# Altium schematic sheet [03] - MATRIX SCHEMATIC.SchDoc
size A2; DocumentNumber: 3; SheetNumber: 3; SheetTotal: 5; PageSetup: Record=PageOptions|CenterHorizontal=True|CenterVertical=True|PrintScale=0.73|XCorrection=1.00|YCorrection=1.00|PrintKind=0|BorderSize=5000000|LeftOffset=0|BottomOffset=0|Orientation=2|PaperLength=1000|PaperWidth=1000|Scale=100|PaperSource=7|PrintQuality=-3|MediaType=1|DitherType=10|PrintScaleMode=1|PaperKind=A3|PaperIndex=8
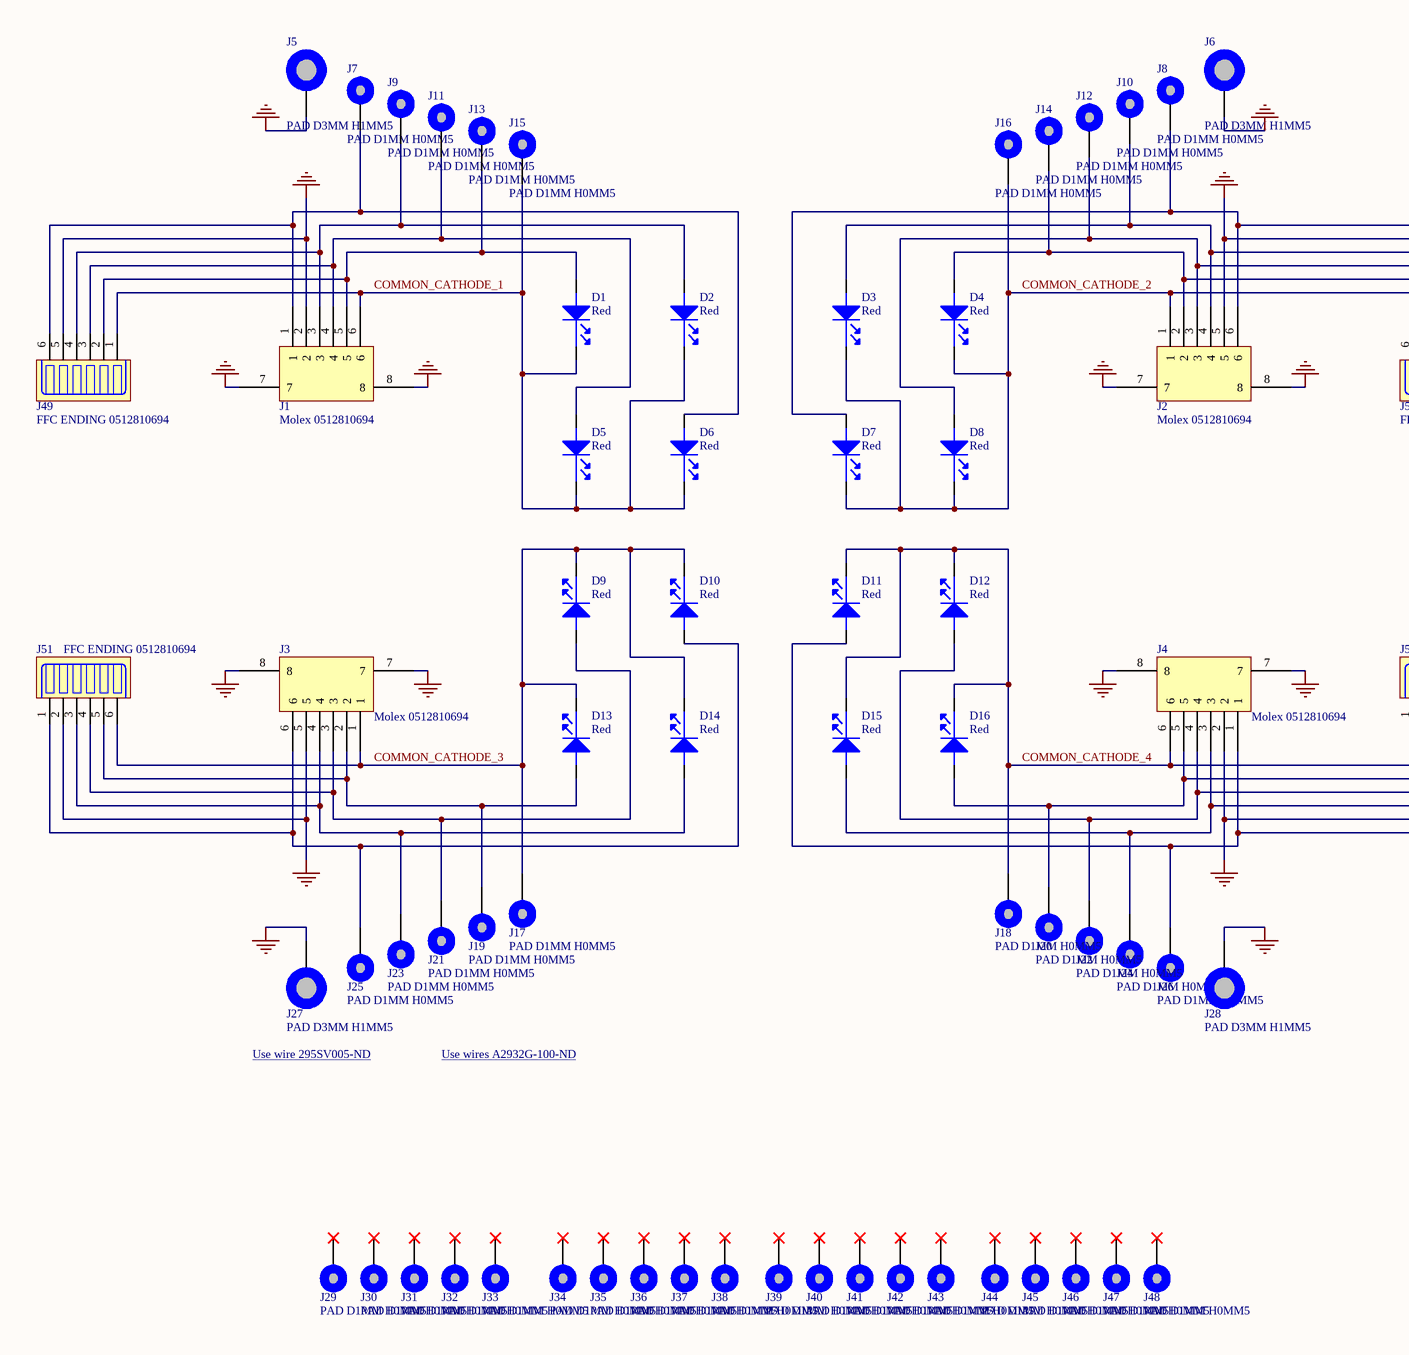
[diagram p0: [03] - MATRIX SCHEMATIC.SchDoc, left]
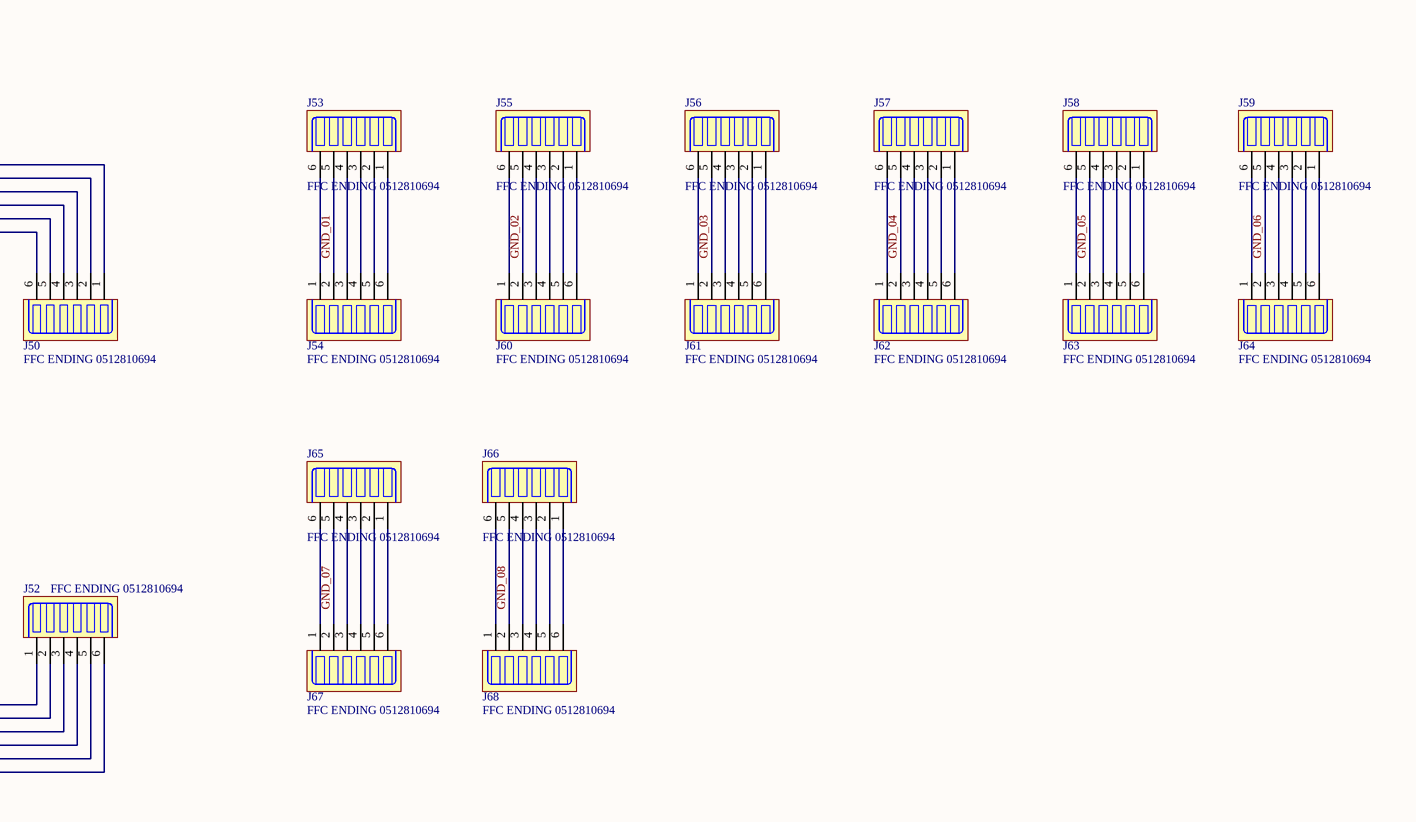
[diagram p1: [03] - MATRIX SCHEMATIC.SchDoc, right]

## Parts
D1  Red  [LED_0603]
D2  Red  [LED_0603]
D3  Red  [LED_0603]
D4  Red  [LED_0603]
D5  Red  [LED_0603]
D6  Red  [LED_0603]
D7  Red  [LED_0603]
D8  Red  [LED_0603]
D9  Red  [LED_0603]
D10  Red  [LED_0603]
D11  Red  [LED_0603]
D12  Red  [LED_0603]
D13  Red  [LED_0603]
D14  Red  [LED_0603]
D15  Red  [LED_0603]
D16  Red  [LED_0603]
J1  Molex 0512810694  [0512810694]
J2  Molex 0512810694  [0512810694]
J3  Molex 0512810694  [0512810694]
J4  Molex 0512810694  [0512810694]
J5  PAD D3MM H1MM5  [PAD_D3MM_H1MM5]  (no BOM)
J6  PAD D3MM H1MM5  [PAD_D3MM_H1MM5]  (no BOM)
J7  PAD D1MM H0MM5  [PAD_D1MM_H0MM5]  (no BOM)
J8  PAD D1MM H0MM5  [PAD_D1MM_H0MM5]  (no BOM)
J9  PAD D1MM H0MM5  [PAD_D1MM_H0MM5]  (no BOM)
J10  PAD D1MM H0MM5  [PAD_D1MM_H0MM5]  (no BOM)
J11  PAD D1MM H0MM5  [PAD_D1MM_H0MM5]  (no BOM)
J12  PAD D1MM H0MM5  [PAD_D1MM_H0MM5]  (no BOM)
J13  PAD D1MM H0MM5  [PAD_D1MM_H0MM5]  (no BOM)
J14  PAD D1MM H0MM5  [PAD_D1MM_H0MM5]  (no BOM)
J15  PAD D1MM H0MM5  [PAD_D1MM_H0MM5]  (no BOM)
J16  PAD D1MM H0MM5  [PAD_D1MM_H0MM5]  (no BOM)
J17  PAD D1MM H0MM5  [PAD_D1MM_H0MM5]  (no BOM)
J18  PAD D1MM H0MM5  [PAD_D1MM_H0MM5]  (no BOM)
J19  PAD D1MM H0MM5  [PAD_D1MM_H0MM5]  (no BOM)
J20  PAD D1MM H0MM5  [PAD_D1MM_H0MM5]  (no BOM)
J21  PAD D1MM H0MM5  [PAD_D1MM_H0MM5]  (no BOM)
J22  PAD D1MM H0MM5  [PAD_D1MM_H0MM5]  (no BOM)
J23  PAD D1MM H0MM5  [PAD_D1MM_H0MM5]  (no BOM)
J24  PAD D1MM H0MM5  [PAD_D1MM_H0MM5]  (no BOM)
J25  PAD D1MM H0MM5  [PAD_D1MM_H0MM5]  (no BOM)
J26  PAD D1MM H0MM5  [PAD_D1MM_H0MM5]  (no BOM)
J27  PAD D3MM H1MM5  [PAD_D3MM_H1MM5]  (no BOM)
J28  PAD D3MM H1MM5  [PAD_D3MM_H1MM5]  (no BOM)
J29  PAD D1MM H0MM5  [PAD_D1MM_H0MM5]  (no BOM)
J30  PAD D1MM H0MM5  [PAD_D1MM_H0MM5]  (no BOM)
J31  PAD D1MM H0MM5  [PAD_D1MM_H0MM5]  (no BOM)
J32  PAD D1MM H0MM5  [PAD_D1MM_H0MM5]  (no BOM)
J33  PAD D1MM H0MM5  [PAD_D1MM_H0MM5]  (no BOM)
J34  PAD D1MM H0MM5  [PAD_D1MM_H0MM5]  (no BOM)
J35  PAD D1MM H0MM5  [PAD_D1MM_H0MM5]  (no BOM)
J36  PAD D1MM H0MM5  [PAD_D1MM_H0MM5]  (no BOM)
J37  PAD D1MM H0MM5  [PAD_D1MM_H0MM5]  (no BOM)
J38  PAD D1MM H0MM5  [PAD_D1MM_H0MM5]  (no BOM)
J39  PAD D1MM H0MM5  [PAD_D1MM_H0MM5]  (no BOM)
J40  PAD D1MM H0MM5  [PAD_D1MM_H0MM5]  (no BOM)
J41  PAD D1MM H0MM5  [PAD_D1MM_H0MM5]  (no BOM)
J42  PAD D1MM H0MM5  [PAD_D1MM_H0MM5]  (no BOM)
J43  PAD D1MM H0MM5  [PAD_D1MM_H0MM5]  (no BOM)
J44  PAD D1MM H0MM5  [PAD_D1MM_H0MM5]  (no BOM)
J45  PAD D1MM H0MM5  [PAD_D1MM_H0MM5]  (no BOM)
J46  PAD D1MM H0MM5  [PAD_D1MM_H0MM5]  (no BOM)
J47  PAD D1MM H0MM5  [PAD_D1MM_H0MM5]  (no BOM)
J48  PAD D1MM H0MM5  [PAD_D1MM_H0MM5]  (no BOM)
J49  FFC ENDING 0512810694  [FFC_ENDING_0512810694]  (no BOM)
J50  FFC ENDING 0512810694  [FFC_ENDING_0512810694]  (no BOM)
J51  FFC ENDING 0512810694  [FFC_ENDING_0512810694]  (no BOM)
J52  FFC ENDING 0512810694  [FFC_ENDING_0512810694]  (no BOM)
J53  FFC ENDING 0512810694  [FFC_ENDING_0512810694]  (no BOM)
J54  FFC ENDING 0512810694  [FFC_ENDING_0512810694]  (no BOM)
J55  FFC ENDING 0512810694  [FFC_ENDING_0512810694]  (no BOM)
J56  FFC ENDING 0512810694  [FFC_ENDING_0512810694]  (no BOM)
J57  FFC ENDING 0512810694  [FFC_ENDING_0512810694]  (no BOM)
J58  FFC ENDING 0512810694  [FFC_ENDING_0512810694]  (no BOM)
J59  FFC ENDING 0512810694  [FFC_ENDING_0512810694]  (no BOM)
J60  FFC ENDING 0512810694  [FFC_ENDING_0512810694]  (no BOM)
J61  FFC ENDING 0512810694  [FFC_ENDING_0512810694]  (no BOM)
J62  FFC ENDING 0512810694  [FFC_ENDING_0512810694]  (no BOM)
J63  FFC ENDING 0512810694  [FFC_ENDING_0512810694]  (no BOM)
J64  FFC ENDING 0512810694  [FFC_ENDING_0512810694]  (no BOM)
J65  FFC ENDING 0512810694  [FFC_ENDING_0512810694]  (no BOM)
J66  FFC ENDING 0512810694  [FFC_ENDING_0512810694]  (no BOM)
J67  FFC ENDING 0512810694  [FFC_ENDING_0512810694]  (no BOM)
J68  FFC ENDING 0512810694  [FFC_ENDING_0512810694]  (no BOM)

## Nets
GND: J1.2 J1.7 J1.8 J2.5 J2.7 J2.8 J3.5 J3.7 J3.8 J4.2 J4.7 J4.8 J5.1 J6.1 J27.1 J28.1 J49.5 J50.2 J51.2 J52.5
COMMON_CATHODE_1: D1.1(cathode) D2.1(cathode) D5.1(cathode) D6.1(cathode) J1.6 J15.1 J49.1
COMMON_CATHODE_2: D3.1(cathode) D4.1(cathode) D7.1(cathode) D8.1(cathode) J2.1 J16.1 J50.6
COMMON_CATHODE_3: D9.1(cathode) D10.1(cathode) D13.1(cathode) D14.1(cathode) J3.1 J17.1 J51.6
COMMON_CATHODE_4: D11.1(cathode) D12.1(cathode) D15.1(cathode) D16.1(cathode) J4.6 J18.1 J52.1
GND_01: J53.5 J54.2
GND_02: J55.5 J60.2
GND_03: J56.5 J61.2
GND_04: J57.5 J62.2
GND_05: J58.5 J63.2
GND_06: J59.5 J64.2
GND_07: J65.5 J67.2
GND_08: J66.5 J68.2
NetD1_2: D1.2(ANODE) J1.5 J13.1 J49.2
NetD2_2: D2.2(ANODE) J1.3 J9.1 J49.4
NetD3_2: D3.2(ANODE) J2.4 J10.1 J50.3
NetD4_2: D4.2(ANODE) J2.2 J14.1 J50.5
NetD5_2: D5.2(ANODE) J1.4 J11.1 J49.3
NetD6_2: D6.2(ANODE) J1.1 J7.1 J49.6
NetD7_2: D7.2(ANODE) J2.6 J8.1 J50.1
NetD8_2: D8.2(ANODE) J2.3 J12.1 J50.4
NetD9_2: D9.2(ANODE) J3.3 J21.1 J51.4
NetD10_2: D10.2(ANODE) J3.6 J25.1 J51.1
NetD11_2: D11.2(ANODE) J4.1 J26.1 J52.6
NetD12_2: D12.2(ANODE) J4.4 J22.1 J52.3
NetD13_2: D13.2(ANODE) J3.2 J19.1 J51.5
NetD14_2: D14.2(ANODE) J3.4 J23.1 J51.3
NetD15_2: D15.2(ANODE) J4.3 J24.1 J52.4
NetD16_2: D16.2(ANODE) J4.5 J20.1 J52.2
NetJ53_1: J53.1 J54.6
NetJ53_2: J53.2 J54.5
NetJ53_3: J53.3 J54.4
NetJ53_4: J53.4 J54.3
NetJ53_6: J53.6 J54.1
NetJ55_1: J55.1 J60.6
NetJ55_2: J55.2 J60.5
NetJ55_3: J55.3 J60.4
NetJ55_4: J55.4 J60.3
NetJ55_6: J55.6 J60.1
NetJ56_1: J56.1 J61.6
NetJ56_2: J56.2 J61.5
NetJ56_3: J56.3 J61.4
NetJ56_4: J56.4 J61.3
NetJ56_6: J56.6 J61.1
NetJ57_1: J57.1 J62.6
NetJ57_2: J57.2 J62.5
NetJ57_3: J57.3 J62.4
NetJ57_4: J57.4 J62.3
NetJ57_6: J57.6 J62.1
NetJ58_1: J58.1 J63.6
NetJ58_2: J58.2 J63.5
NetJ58_3: J58.3 J63.4
NetJ58_4: J58.4 J63.3
NetJ58_6: J58.6 J63.1
NetJ59_1: J59.1 J64.6
NetJ59_2: J59.2 J64.5
NetJ59_3: J59.3 J64.4
NetJ59_4: J59.4 J64.3
NetJ59_6: J59.6 J64.1
NetJ65_1: J65.1 J67.6
NetJ65_2: J65.2 J67.5
NetJ65_3: J65.3 J67.4
NetJ65_4: J65.4 J67.3
NetJ65_6: J65.6 J67.1
NetJ66_1: J66.1 J68.6
NetJ66_2: J66.2 J68.5
NetJ66_3: J66.3 J68.4
NetJ66_4: J66.4 J68.3
NetJ66_6: J66.6 J68.1

Not connected (* = marked no-connect by the designer): J29 1*; J30 1*; J31 1*; J32 1*; J33 1*; J34 1*; J35 1*; J36 1*; J37 1*; J38 1*; J39 1*; J40 1*; J41 1*; J42 1*; J43 1*; J44 1*; J45 1*; J46 1*; J47 1*; J48 1*

## Notes on the sheet
- Use wire 295SV005-ND <https://www.digikey.com/products/en?keywords=%09295%20SV005>
- Use wires A2932G-100-ND <https://www.digikey.com/product-detail/en/alpha-wire/2932-GR005/A2932G-100-ND/7349790>

## Library data of the parts
D1-D16 = LS L29K-H1J2-1-Z: LED SMARTLED RED 630NM 0603 SMD; Manufacturer: OSRAM Opto Semiconductors Inc; Millicandela Rating: 4.95mcd; Voltage - Forward (Vf) Typ: 1.8V; Current - Test: 2mA; Wavelength - Peak: 643nm; Viewing Angle: 160°; Lens Type: Diffused; Lens Style/Size: Rectangle with Flat Top, 1.3mm x 0.8mm; Luminous Flux @ Current - Test: 20 mlm; .Checked PCB: used; Supplier 1: Digi-Key; Supplier Part Number 1: 475-1195-1-ND; Manufacturer Part Number: LS L29K-H1J2-1-Z; RoHS: RoHS Compliant; Category: Optoelectronics; Stock 1: 71670; Pricing 1: 1=0.16, 10=0.137, 100=0.1093, 250=0.09564, 500=0.08744 (USD); Color: Red; Wavelength - Dominant: 630nm; Package / Case: 0603 (1608 Metric); Size / Dimension: 1.70mm L x 0.80mm W; Height: 0.65mm; Mounting Type: Surface Mount; Packaging: Cut Tape (CT); ComponentLink1URL: http://catalog.osram-os.com/catalogue/catalogue.do;jsessionid=DB7CFDBAC5AF1E216E45F622E867085A?act=downloadFile&favOid=020000010003f9de000100b6; ComponentLink1Description: http://catalog.osram-os.com/catalogue/catalogue.do;jsessionid=DB7CFDBAC5AF1E216E45F622E867085A?act=downloadFile&favOid=020000010003f9de000100b6; .Checked SCH: used
J1-J4 = 0512810694: Conn FPC Connector SKT 6 POS 0.5mm Solder RA SMD Easy-On™ Embossed T/R; Current Rating: 500mA; Voltage Rating: 50V; Contact Resistance: 20mR; Number of Positions: 6; Wire/Cable Type: Straight; .Creator: RF; Supplier 1: Digi-Key; Supplier Part Number 1: WM10922DKR-ND; Manufacturer: Molex; Manufacturer Part Number: 0512810694; Stock 1: 21985; Pricing 1: 1=0.54, 10=0.507, 25=0.456, 50=0.4056, 100=0.3886, 250=0.3548, 500=0.33792, 1000=0.27878 (USD); Mount: Surface Mount; Contact Material: Bronze; Contact Plating: Gold; Housing Colour: Natural; Housing Material: Polymer; Min Operating Temperature: -20°C; Max Operating Temperature: 85°C; Package Quantity: 3000; Packaging: Tape and Reel; Number of Rows: 1; Termination: Solder; Number of Contacts: 6; Orientation: Right Angle; Length: 5.1mm; Pitch: 0.5mm; Depth: 3.75mm; Radiation Hardening: No; Flammability Rating: UL94 V-0; ComponentLink1URL: http://www.molex.com/pdm_docs/sd/512810694_sd.pdf; ComponentLink1Description: http://www.molex.com/pdm_docs/sd/512810694_sd.pdf; ComponentLink2URL: http://www.molex.com/webdocs/datasheets/pdf/en-us/0512810694_FFC_FPC_CONNECTORS.pdf; ComponentLink2Description: http://www.molex.com/webdocs/datasheets/pdf/en-us/0512810694_FFC_FPC_CONNECTORS.pdf; ComponentLink3URL: https://www.verical.com/server-webapp/html/getDatasheet?partID=195210; ComponentLink3Description: https://www.verical.com/server-webapp/html/getDatasheet?partID=195210; Category: Connectors, Interconnects; Parameter 1: *